# EAGLE schematic Open_SDA_INTERFACE (EAGLE 8.6.0)
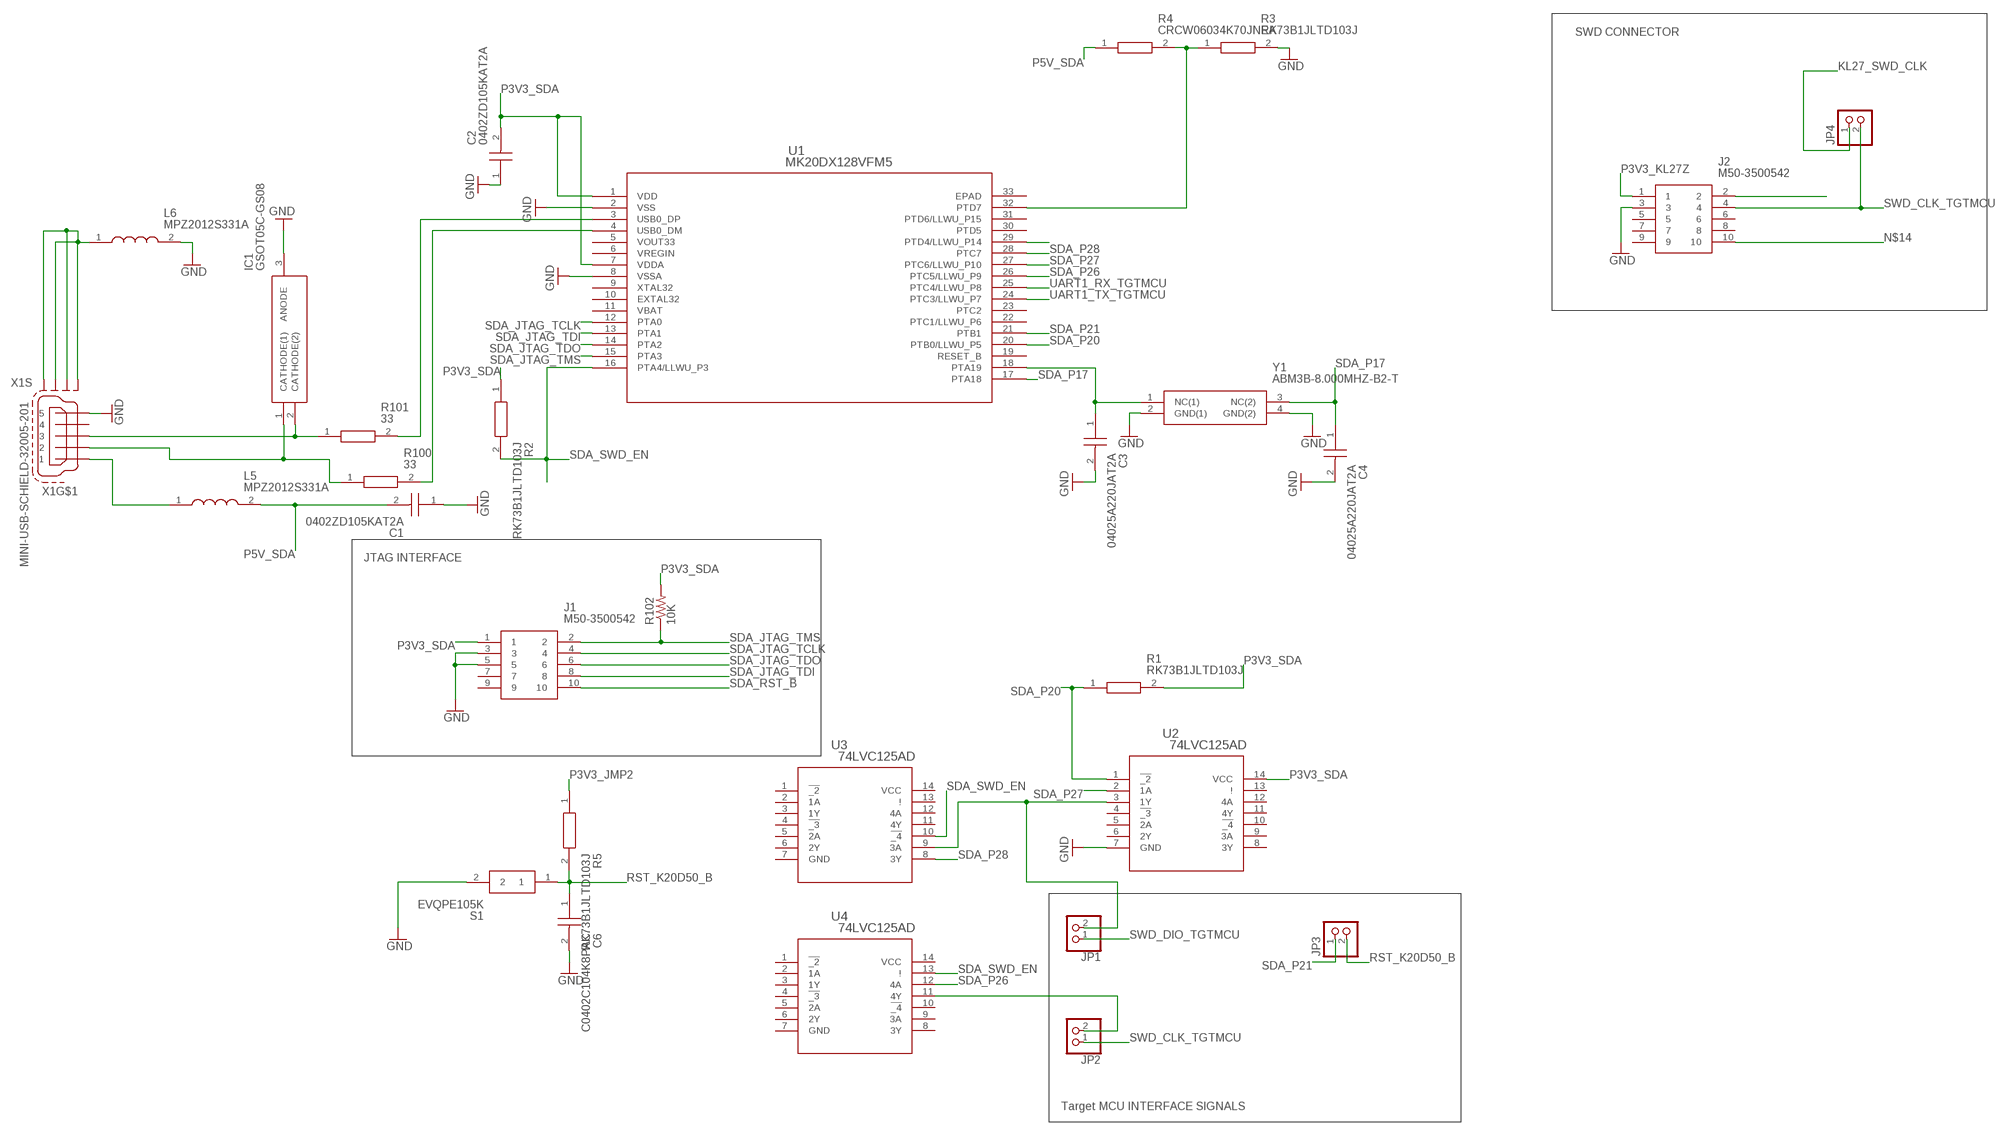
[diagram p0: schematic, sheet 1]

## Parts
C1  0402ZD105KAT2A  [CAPC1005X56N]
C2  0402ZD105KAT2A  [CAPC1005X56N]
C3  04025A220JAT2A  [CAPC1005X56N]
C4  04025A220JAT2A  [CAPC1005X56N]
C6  C0402C104K8PAC  [CAPC1005X55N]
IC1  GSOT05C-GS08  [SOT95P248X115-3N]
J1  M50-3500542  [HDRV10W40P127_2X5_635X345X415P]
J2  M50-3500542  [HDRV10W40P127_2X5_635X345X415P]
JP1  PINHD-1X2/90  [1X02/90]
JP2  PINHD-1X2/90  [1X02/90]
JP3  PINHD-1X2/90  [1X02/90]
JP4  PINHD-1X2/90  [1X02/90]
L5  MPZ2012S331A  MPZ2012S331AT000  [INDC2012X105N]
L6  MPZ2012S331A  MPZ2012S331AT000  [INDC2012X105N]
R1  RK73B1JLTD103J  [RESC1608X55N]
R2  RK73B1JLTD103J  [RESC1608X55N]
R3  RK73B1JLTD103J  [RESC1608X55N]
R4  CRCW06034K70JNEA  [RESC1608X50N]
R5  RK73B1JLTD103J  [RESC1608X55N]
R100  33  RC0402FR-0733RL  [RESC1005X40N]
R101  33  RC0402FR-0733RL  [RESC1005X40N]
R102  10K  R-US_M1206  [M1206]
S1  EVQPE105K  [EVQPE1]
U1  MK20DX128VFM5  [QFN-32_5X5X0.9]
U2  74LVC125AD  [SOT108-1]
U3  74LVC125AD  [SOT108-1]
U4  74LVC125AD  [SOT108-1]
X1  MINI-USB-SCHIELD-32005-201  [32005-201]
Y1  ABM3B-8.000MHZ-B2-T  [ABM3B]

## Nets
GND: C2.1 IC1.3(ANODE) J1.3 J1.5 J2.3 L6.2 S1.2 U1.2(VSS) U1.8(VSSA) X1.5 Y1.4(GND(2))
KL27_SWD_CLK: JP4.1
N$1: C1.1
N$2: C3.1 U1.18(PTA19) Y1.1(NC(1))
N$3: Y1.2(GND(1)) ; supply symbol labelled GND
N$4: C3.2 ; supply symbol labelled GND
N$5: U2.7(GND)
N$7: C4.2 ; supply symbol labelled GND
N$8: U1.29(PTD4/LLWU_P14)
N$9: JP2.2 U4.11(4Y)
N$10: R3.1 R4.2 U1.32(PTD7)
N$11: R3.2
N$12: C6.2
N$13: JP1.2 U2.3(1Y) U3.9(3A)
N$14: J2.10
N$15: J2.2
N$71: IC1.2(CATHODE(2)) R101.1 X1.3
N$72: L5.1 X1.1
N$73: IC1.1(CATHODE(1)) R100.1 X1.2
N$74: L6.1 X1.M1(S:S1) X1.M2(S:S2) X1.M3(S:S3) X1.M4(S:S4)
P3V3_JMP2: R5.1
P3V3_KL27Z: J2.1
P3V3_SDA: C2.2 J1.1 R1.2 R2.1 R102.2 U1.1(VDD) U1.7(VDDA) U2.14(VCC)
P5V_SDA: C1.2 L5.2 R4.1
RST_K20D50_B: C6.1 JP3.2 R5.2 S1.1
SDA_JTAG_TCLK: J1.4 U1.12(PTA0)
SDA_JTAG_TDI: J1.8 U1.13(PTA1)
SDA_JTAG_TDO: J1.6 U1.14(PTA2)
SDA_JTAG_TMS: J1.2 R102.1 U1.15(PTA3)
SDA_P17: C4.1 U1.17(PTA18) Y1.3(NC(2))
SDA_P20: R1.1 U1.20(PTB0/LLWU_P5) U2.1(!_2)
SDA_P21: JP3.1 U1.21(PTB1)
SDA_P26: U1.26(PTC5/LLWU_P9) U4.12(4A)
SDA_P27: U1.27(PTC6/LLWU_P10) U2.2(1A)
SDA_P28: U1.28(PTC7) U3.8(3Y)
SDA_RST_B: J1.10
SDA_SWD_EN: R2.2 U1.16(PTA4/LLWU_P3) U3.10(!_4) U4.13(!)
SWD_CLK_TGTMCU: J2.4 JP2.1
SWD_DIO_TGTMCU: JP1.1
UART1_RX_TGTMCU: U1.25(PTC4/LLWU_P8)
UART1_TX_TGTMCU: U1.24(PTC3/LLWU_P7)
USB_DM: R100.2 U1.4(USB0_DM)
USB_DP: R101.2 U1.3(USB0_DP)
Unconnected: J1.7 J1.9 J2.5 J2.6 J2.7 J2.8 J2.9 JP4.2 U1.5(VOUT33) U1.6(VREGIN) U1.9(XTAL32) U1.10(EXTAL32) U1.19(RESET_B) U1.22(PTC1/LLWU_P6) U1.23(PTC2) U1.30(PTD5) U1.31(PTD6/LLWU_P15) U1.33(EPAD) U2.4(!_3) U2.5(2A) U2.6(2Y) U2.8(3Y) U2.9(3A) U2.10(!_4) U2.11(4Y) U2.12(4A) U2.13(!) U3.1(!_2) U3.2(1A) U3.3(1Y) U3.4(!_3) U3.5(2A) U3.6(2Y) U3.11(4Y) U3.12(4A) U3.13(!) U4.1(!_2) U4.2(1A) U4.3(1Y) U4.4(!_3) U4.5(2A) U4.6(2Y) U4.8(3Y) U4.9(3A) U4.10(!_4) X1.4

## Notes on the sheet
- SWD CONNECTOR
- JTAG INTERFACE
- Target MCU INTERFACE SIGNALS

## Power pins joined to a net without a drawn wire
GND: U3.7(GND) U4.7(GND)
VBAT: U1.11(VBAT)
VCC: U3.14(VCC) U4.14(VCC)

## Library data of the parts
C1 C2 = 0402ZD105KAT2A:0402ZD105KAT2A: AVX - 0402ZD105KAT2A - CAP, MLCC, X5R, 1UF, 10V, 0402 Source: Datasheet <http://www.mouser.com/catalog/supplier/library/pdf/AVXSurfaceMountCeramic.pdf>; DESCRIPTION: AVX - 0402ZD105KAT2A - CAP, MLCC, X5R, 1UF, 10V, 0402; HEIGHT: 0.56mm; MANUFACTURER_NAME: AVX; MANUFACTURER_PART_NUMBER: 0402ZD105KAT2A; RS_PART_NUMBER: 8882699; RS_PRICE/STOCK: http://uk.rs-online.com/web/p/products/8882699
C3 C4 = 04025A220JAT2A:04025A220JAT2A: Capacitor MLCC 0402 22pF 50V AVX 0402 Standard 22pF Ceramic Multilayer Capacitor, 50 V dc C0G Dielectric 5% SMD Source: Datasheet <http://www.mouser.com/catalog/supplier/library/pdf/AVXSurfaceMountCeramic.pdf>; DESCRIPTION: Capacitor MLCC 0402 22pF 50V AVX 0402 Standard 22pF Ceramic Multilayer Capacitor, 50 V dc C0G Dielectric 5% SMD; HEIGHT: 0.56mm; MANUFACTURER_NAME: AVX; MANUFACTURER_PART_NUMBER: 04025A220JAT2A; RS_PART_NUMBER: 1243267; RS_PRICE/STOCK: http://uk.rs-online.com/web/p/products/1243267
C6 = C0402C104K8PAC:C0402C104K8PAC: Multilayer Ceramic Capacitors MLCC - SMD/SMT 10volts 0.1uF 10% X5R Source: Datasheet <https://content.kemet.com/datasheets/KEM_C1002_X7R_SMD.pdf>; DESCRIPTION: Multilayer Ceramic Capacitors MLCC - SMD/SMT 10volts 0.1uF 10% X5R; HEIGHT: 0.55mm; MANUFACTURER_NAME: Kemet; MANUFACTURER_PART_NUMBER: C0402C104K8PAC
IC1 = GSOT05C-GS08:GSOT05C-GS08: VISHAY - GSOT05C-GS08 - TVS DIODE ARRAY, 504W, 5V, SOT-23, FULL REEL Source: Datasheet <https://www.vishay.com/docs/85824/gsot03c.pdf>; DESCRIPTION: VISHAY - GSOT05C-GS08 - TVS DIODE ARRAY, 504W, 5V, SOT-23, FULL REEL; HEIGHT: 1.15mm; MANUFACTURER_NAME: Vishay; MANUFACTURER_PART_NUMBER: GSOT05C-GS08
J1 J2 = M50-3500542:M50-3500542: Header 2x5way DIL VERT Pin HARWIN M50-35 Series, 1.27mm Pitch 10 Way 2 Row Straight PCB Header, Solder Termination, 1A Source: Datasheet <http://docs-europe.electrocomponents.com/webdocs/13d4/0900766b813d4011.pdf>; DESCRIPTION: Header 2x5way DIL VERT Pin HARWIN M50-35 Series, 1.27mm Pitch 10 Way 2 Row Straight PCB Header, Solder Termination, 1A; HEIGHT: 4.15mm; MANUFACTURER_NAME: HARWIN; MANUFACTURER_PART_NUMBER: M50-3500542; RS_PART_NUMBER: 6811184P; RS_PRICE/STOCK: http://uk.rs-online.com/web/p/products/6811184P
JP1-JP4 = pinhead:PINHD-1X2: PIN HEADER
L5 L6 = MPZ2012S331AT000:MPZ2012S331AT000: Ferrite Beads Multi-Layer Power 330Ohm 25% 100MHz 2.5A 50mOhm DCR 0805 T/R Source: Datasheet <https://product.tdk.com/info/en/catalog/datasheets/beads_commercial_power_mpz2012_en.pdf>; DESCRIPTION: Ferrite Beads Multi-Layer Power 330Ohm 25% 100MHz 2.5A 50mOhm DCR 0805 T/R; HEIGHT: 1.05mm; MANUFACTURER_NAME: TDK; MANUFACTURER_PART_NUMBER: MPZ2012S331AT000
R1-R3 R5 = RK73B1JLTD103J:RK73B1JLTD103J: Thick Film Resistors - SMD 1/10watts 10Kohms 5% Source: Datasheet <http://www.koaspeer.com/catimages/Products/RK73-RT/RK73-RT.pdf>; DESCRIPTION: Thick Film Resistors - SMD 1/10watts 10Kohms 5%; HEIGHT: 0.55mm; MANUFACTURER_NAME: KOA Speer; MANUFACTURER_PART_NUMBER: RK73B1JLTD103J
R4 = CRCW06034K70JNEA:CRCW06034K70JNEA: Vishay CRCW Series Thick Film Surface Mount Resistor 0603 Case 4.7k 5% 0.1W 200ppm/K Source: Datasheet <http://www.vishay.com/docs/20035/dcrcwe3.pdf>; DESCRIPTION: Vishay CRCW Series Thick Film Surface Mount Resistor 0603 Case 4.7k 5% 0.1W 200ppm/K; HEIGHT: 0.5mm; MANUFACTURER_NAME: Vishay; MANUFACTURER_PART_NUMBER: CRCW06034K70JNEA; RS_PART_NUMBER: 8306488; RS_PRICE/STOCK: https://uk.rs-online.com/web/p/products/8306488
R100 R101 = RC0402FR-0733RL:RC0402FR-0733RL: YAGEO (PHYCOMP) - RC0402FR-0733RL - RES, THICK FILM, 33R, 1%, 0.0625W, 0402 Source: Datasheet <http://www.yageo.com/documents/recent/PYu-RC0402_51_RoHS_L_6_r.pdf>; DESCRIPTION: YAGEO (PHYCOMP) - RC0402FR-0733RL - RES, THICK FILM, 33R, 1%, 0.0625W, 0402; HEIGHT: 0.4mm; MANUFACTURER_NAME: YAGEO (PHYCOMP); MANUFACTURER_PART_NUMBER: RC0402FR-0733RL
R102 = rcl:R-US_: RESISTOR, American symbol; SPICEPREFIX: R
S1 = EVQPE105K:EVQPE105K: Tact switch,SMT,SPST,black,1.0N op force Black Push Plate Tactile Switch, SPST-NO 50 mA 5mm Source: Datasheet <http://uk.rs-online.com/web/p/products/7561669>; DESCRIPTION: Tact switch,SMT,SPST,black,1.0N op force Black Push Plate Tactile Switch, SPST-NO 50 mA 5mm; HEIGHT: mm; MANUFACTURER_NAME: Panasonic; MANUFACTURER_PART_NUMBER: EVQPE105K; RS_PART_NUMBER: 7561669; RS_PRICE/STOCK: http://uk.rs-online.com/web/p/products/7561669
U1 = MK20DX128VFM5:MK20DX128VFM5; CPU: ARM Cortex-M4; FLASHKB: 128; MANUFACTURER_PART_NUMBER: mk20dx128vfm5; MAXFREQUENCY: 50; PINCOUNT: 32; SRAMKB: 16; VENDOR: FREESCALE
U2-U4 = 74LVC125ADB:74LVC125AD; MANUFACTURER_PART_NUMBER: 74LVC125AD; VENDOR: NXP
X1 = con-cypressindustries:MINI-USB-SCHIELD-: MINI USB-B Conector Source: www.cypressindustries.com; OC_FARNELL: unknown; OC_NEWARK: unknown
Y1 = ABM3B-8.000MHZ-B2-T:ABM3B-8.000MHZ-B2-T: ABRACON - ABM3B-8.000MHZ-B2-T - CRYSTAL, 8MHZ, 18PF, 5 X 3.2MM Source: Datasheet <http://www.abracon.com/Resonators/abm3b.pdf>; DESCRIPTION: ABRACON - ABM3B-8.000MHZ-B2-T - CRYSTAL, 8MHZ, 18PF, 5 X 3.2MM; HEIGHT: mm; MANUFACTURER_NAME: ABRACON; MANUFACTURER_PART_NUMBER: ABM3B-8.000MHZ-B2-T